# EAGLE design NES64controller (EAGLE 9.3.0)
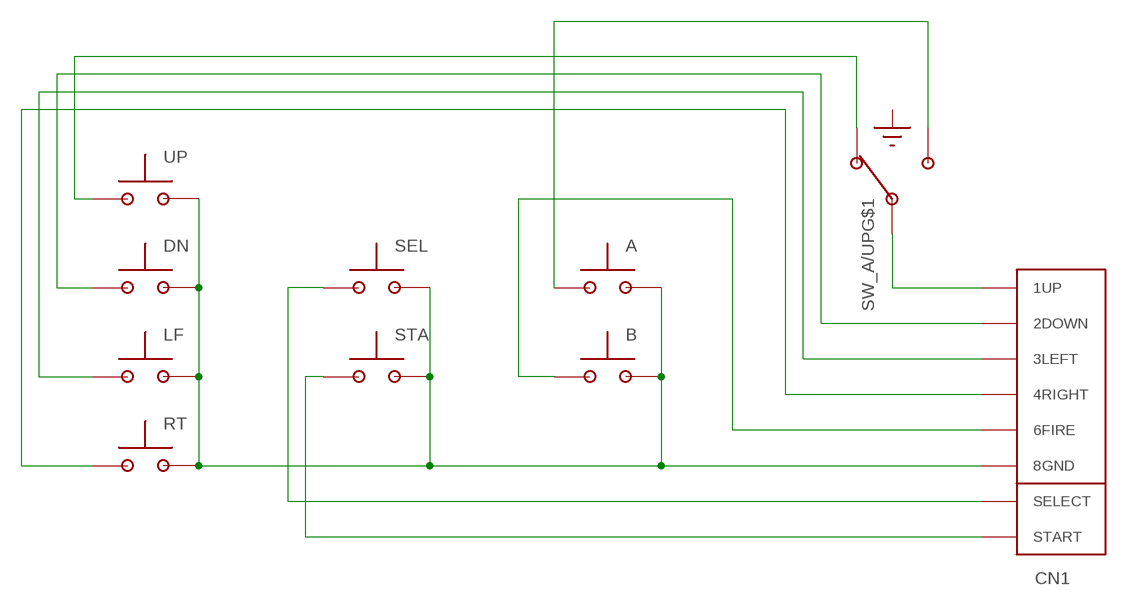
[diagram p0: schematic, sheet 1]

## Parts
A  RUBBERBUTTON_CONTACTAREA_9MM  [RUBBERBUTTON_CONTACTAREA_9MM]
B  RUBBERBUTTON_CONTACTAREA_9MM  [RUBBERBUTTON_CONTACTAREA_9MM]
CN1  NES64_CONNECTOR  [NES64_CONNECTOR]
DN  RUBBERBUTTON_CONTACTAREA_9MM  [RUBBERBUTTON_CONTACTAREA_9MM]
LF  RUBBERBUTTON_CONTACTAREA_9MM  [RUBBERBUTTON_CONTACTAREA_9MM]
RT  RUBBERBUTTON_CONTACTAREA_9MM  [RUBBERBUTTON_CONTACTAREA_9MM]
SEL  RUBBERBUTTON_CONTACTAREA_9MM  [RUBBERBUTTON_CONTACTAREA_9MM]
STA  RUBBERBUTTON_CONTACTAREA_9MM  [RUBBERBUTTON_CONTACTAREA_9MM]
SW_A/UP  TOGGLESWITCH_SPDT_SMALL_90DEG  [TOGGLESWITCH_SPDT_SMALL_90DEG]
UP  RUBBERBUTTON_CONTACTAREA_9MM  [RUBBERBUTTON_CONTACTAREA_9MM]

## Nets
N$1: A.B B.B CN1.8GND DN.B LF.B RT.B SEL.B STA.B UP.B
N$2: CN1.1UP SW_A/UP.N
N$3: B.A CN1.6FIRE
N$4: CN1.START STA.A
N$5: CN1.SELECT SEL.A
N$6: CN1.4RIGHT RT.A
N$7: CN1.3LEFT LF.A
N$8: CN1.2DOWN DN.A
N$9: SW_A/UP.A UP.A
N$10: A.A SW_A/UP.B
Unconnected: SW_A/UP.GND@1(GND) SW_A/UP.GND@2(GND)

## Library data of the parts
A B DN LF RT SEL STA UP = Thomas:RUBBERBUTTON_CONTACTAREA_9MM
CN1 = Thomas:NES64_CONNECTOR
SW_A/UP = Thomas:TOGGLESWITCH_SPDT_SMALL_90DEG

## Board
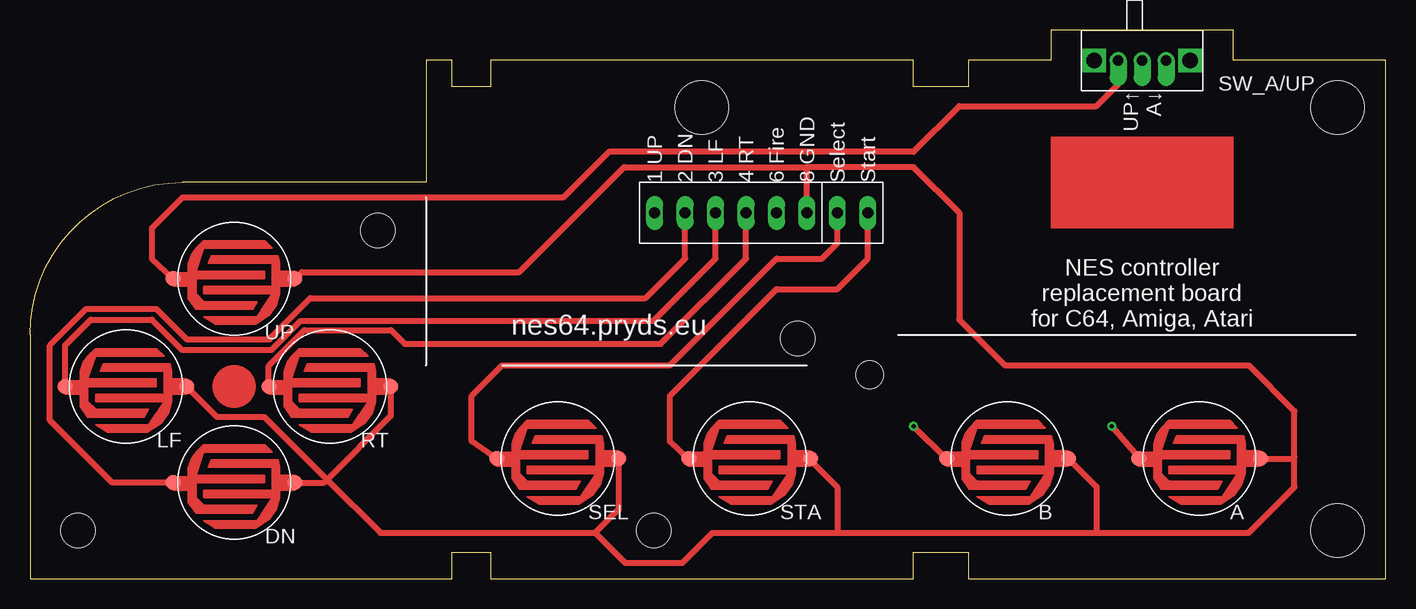
[diagram p1: board, top side]
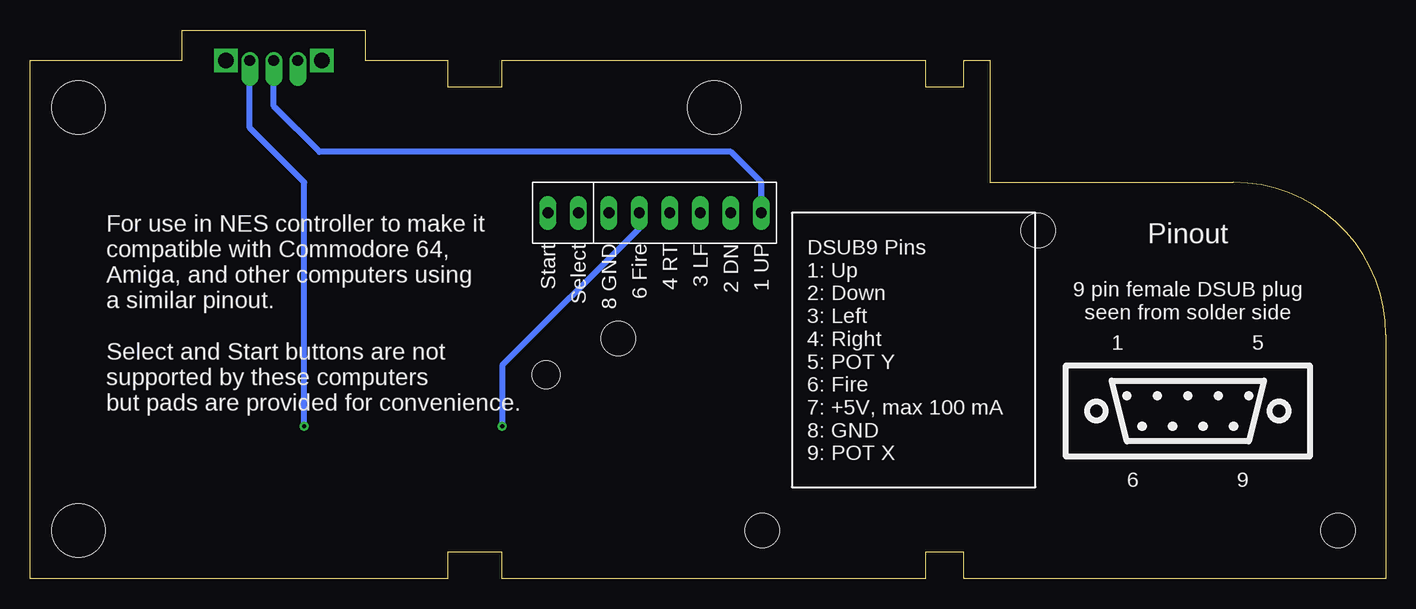
[diagram p2: board, bottom side, seen from below]

Size 113.03 x 45.72 mm. Coordinates in mm from the lower left corner, seen from the top.
Outline: 0,0 35.18,0 35.18,2.18 38.41,2.18 38.41,0 73.66,0 73.66,2.18 78.23,2.18 78.23,0 113.03,0 113.03,43.18 100.33,43.18 100.33,45.72 85.09,45.72 85.09,43.18 78.23,43.18 78.23,41 73.66,41 73.66,43.18 38.41,43.18 38.41,41 35.18,41 35.18,43.18 33.02,43.18 33.02,33.02 12.7,33.02 arc90 0,20.32 0,0
Copper layers (1*16): Top 0.035mm / dielectric 1.5mm / Bottom 0.035mm
Design rules "default": minimum track width 6mil, minimum drill 0.35mm, track to track 6mil, track to pad 6mil, pad to pad 6mil, via to via 6mil, smd to smd 6mil, copper to edge 40mil, drill to drill 6mil, minimum pad ring 10mil, minimum via ring 8mil, stop-mask expansion 4mil, vias tented up to drill 0mil, thermal gap 10mil
Holes 2.85 mm at 4,4 52,4 29,29 64,20
Holes 4.44 mm at 109,4 109,39.25 56,39.25
Holes 2.3 mm at 70,16.99

### Footprints (pad centres in the part's own frame; a part is rotated, then mirrored left to right if it is on the bottom)
RUBBERBUTTON_CONTACTAREA_9MM = smd 1.27 x 1.27: A -5.08,0; B 5.08,0
NES64_CONNECTOR = drill 0.9 long: 1UP -8.89,0; 2DOWN -6.35,0; 3LEFT -3.81,0; 4RIGHT -1.27,0; 6FIRE 1.27,0; 8GND 3.81,0; SELECT 6.35,0; START 8.89,0
TOGGLESWITCH_SPDT_SMALL_90DEG = drill 0.9 offset: A -2,0; B 2,0; N 0,0 | drill 1.3 square: GND@1 -4,0; GND@2 4,0

### Placement (x,y rotation side)
A  97.49,10.01 0 top
B  81.48,10.01 0 top
CN1  60.96,30.48 0 top
DN  17.02,8 0 top
LF  8,16 0 top
RT  24.99,16 0 top
SEL  43.99,10.01 0 top
STA  59.99,10.01 0 top
SW_A/UP  92.71,43.18 0 top
UP  17.02,24.99 0 top

### Tracks (layer width: path | path; a pad name or v marks a point on that pad's centre or on a via)
N$1
  Top 0.508: LF.B 15.62,13.46 19.56,13.46 24.77,8.26 | 24.77,8.26 29.21,3.81 47.11,3.81 | DN.B 24.51,8 24.77,8.26 | RT.B 30.07,13.56 24.77,8.26 | 67.31,3.81 56.89,3.81 54.39,1.3 49.61,1.3 47.11,3.81 | 67.31,3.81 88.9,3.81 | SEL.B 49.07,5.77 47.11,3.81 | STA.B 65.08,9.86 67.31,7.62 67.31,3.81 | B.B 88.9,7.67 88.9,3.81 | 105.41,10.16 105.41,7.62 101.6,3.81 88.9,3.81 | 105.41,10.16 105.41,13.97 101.6,17.78 81.28,17.78 77.47,21.59 77.47,30.48 73.66,34.29 64.77,34.29 | A.B 105.26,10.01 105.41,10.16 | 64.77,34.29 49.53,34.29 40.78,25.54 22.65,25.54 UP.B | CN1.8GND 64.77,34.29
N$2
  Bottom 0.508: CN1.1UP 52.07,33.02 54.61,35.56 88.9,35.56 92.71,39.37 SW_A/UP.N
N$3  (via drill 0.35)
  Top 0.508: B.A v73.66,12.7
  Bottom 0.508: CN1.6FIRE 62.23,29.21 73.66,17.78 v73.66,12.7
N$4
  Top 0.508: STA.A 53.34,11.43 53.34,15.24 62.23,24.13 67.31,24.13 69.85,26.67 CN1.START
N$5
  Top 0.508: SEL.A 36.83,11.43 36.83,15.24 39.37,17.78 53.34,17.78 62.23,26.67 66.04,26.67 67.31,27.94 CN1.SELECT
N$6
  Top 0.508: RT.A 19.91,17.75 22.86,20.7 30.1,20.7 31.24,19.56 52.58,19.56 59.69,26.67 CN1.4RIGHT
N$7
  Top 0.508: LF.A 2.92,19.43 5.08,21.59 10.16,21.59 12.7,19.05 20.11,19.05 22.53,21.47 51.95,21.47 57.15,26.67 CN1.3LEFT
N$8
  Top 0.508: DN.A 6.86,8 1.65,13.21 1.65,19.43 4.7,22.48 10.54,22.48 13.08,19.94 19.94,19.94 23.37,23.37 51.31,23.37 54.61,26.67 CN1.2DOWN
N$9
  Top 0.508: UP.A 10.16,26.67 10.16,29.21 12.7,31.75 44.45,31.75 48.26,35.56 73.66,35.56 77.47,39.37 88.9,39.37 90.71,41.18 SW_A/UP.A
N$10  (via drill 0.35)
  Top 0.508: A.A 92.41,10.17 v90.17,12.7
  Bottom 0.508: v90.17,12.7 90.17,33.02 94.71,37.56 SW_A/UP.B
(copper drawn outside any net)
  shapes: Top area x1, Top circle x1

### Text on the board
tPlace: UP↑ / A↓ | NES controller / replacement board / for C64, Amiga, Atari | nes64.pryds.eu
bPlace: Pinout | 9 pin female DSUB plug / seen from solder side | 5 | 1 | DSUB9 Pins / 1: Up / 2: Down / 3: Left / 4: Right / 5: POT Y / 6: Fire / 7: +5V, max 100 mA / 8: GND / 9: POT X | For use in NES controller to make it / compatible with Commodore 64, / Amiga, and other computers using / a similar pinout. / / Select and Start buttons are not / supported by these computers / but pads are provided for convenience. | 9 | 6
tStop: NES64 | version 0.2
tDocu: Board thickness: 1.6 mm